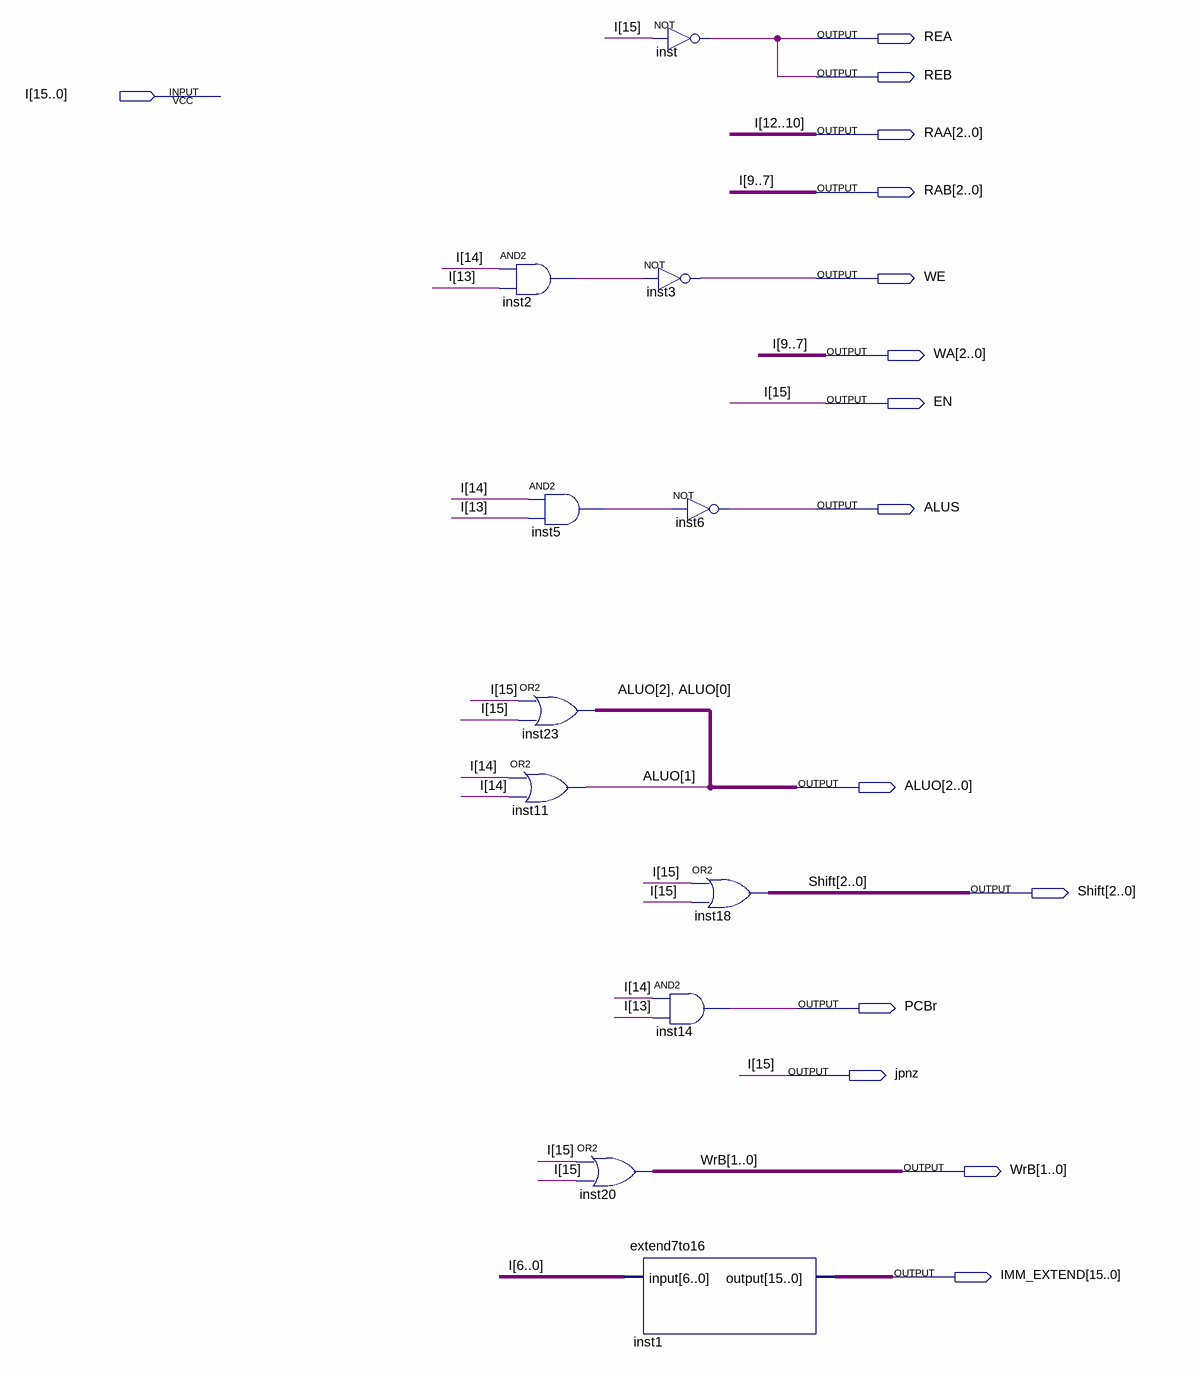
[diagram p0: schematic sheet]
// Quartus schematic RRI.bdf as structural Verilog: 11 symbols, 15 pins
module RRI (
  input  [15:0] I,
  output REA,
  output REB,
  output [2:0] RAA,
  output [2:0] RAB,
  output WE,
  output [2:0] WA,
  output EN,
  output ALUS,
  output [2:0] ALUO,
  output [2:0] Shift,
  output PCBr,
  output jpnz,
  output [1:0] WrB,
  output [15:0] IMM_EXTEND
);

  wire inst2_out, inst5_out;

  and inst2 (inst2_out, I[14], I[13]);
  and inst5 (inst5_out, I[14], I[13]);
  assign {ALUO[2], ALUO[0]} = {2{I[15]}} | {2{I[15]}};  // OR2 inst23, 2 bits wide
  or inst11 (ALUO[1], I[14], I[14]);
  assign WrB = {2{I[15]}} | {2{I[15]}};  // OR2 inst20, 2 bits wide
  extend7to16 inst1 (.\input (I[6:0]), .\output (IMM_EXTEND));
  not inst (REA, I[15]);
  not inst3 (WE, inst2_out);
  not inst6 (ALUS, inst5_out);
  assign Shift = {3{I[15]}} | {3{I[15]}};  // OR2 inst18, 3 bits wide
  and inst14 (PCBr, I[14], I[13]);

  assign EN = I[15];
  assign jpnz = I[15];
  assign RAA = I[12:10];
  assign RAB = I[9:7];
  assign REB = REA;
  assign WA = I[9:7];
endmodule
